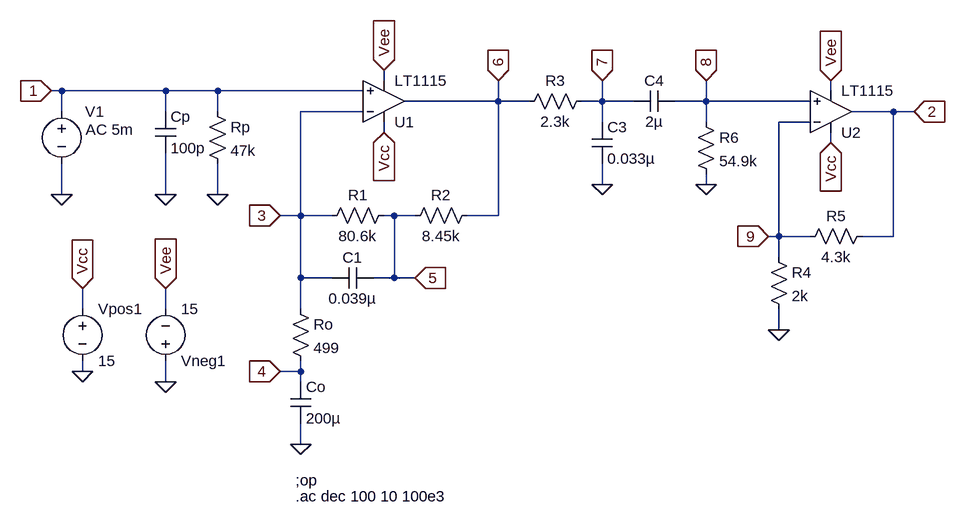
[diagram p0: schematic Two amplifier RIAA Phone Preamp v0b.asc]
Two amplifier RIAA Phone Preamp v0b.asc, the LTspice schematic file:
Version 4
SHEET 1 1876 1124
WIRE 240 160 240 144
WIRE -256 176 -272 176
WIRE -96 176 -256 176
WIRE -16 176 -96 176
WIRE 208 176 -16 176
WIRE 928 176 928 160
WIRE 416 192 416 160
WIRE 416 192 272 192
WIRE 464 192 416 192
WIRE 576 192 576 160
WIRE 576 192 544 192
WIRE 624 192 576 192
WIRE 736 192 736 160
WIRE 736 192 688 192
WIRE 896 192 736 192
WIRE -256 208 -256 176
WIRE -96 208 -96 176
WIRE -16 208 -16 176
WIRE 208 208 112 208
WIRE 1024 208 960 208
WIRE 1056 208 1024 208
WIRE 576 224 576 192
WIRE 736 224 736 192
WIRE 896 224 848 224
WIRE 240 240 240 224
WIRE 928 256 928 240
WIRE 576 320 576 288
WIRE 736 320 736 304
WIRE -256 336 -256 288
WIRE -96 336 -96 272
WIRE -16 336 -16 288
WIRE 112 368 112 208
WIRE 112 368 80 368
WIRE 160 368 112 368
WIRE 256 368 240 368
WIRE 288 368 256 368
WIRE 416 368 416 192
WIRE 416 368 368 368
WIRE 848 400 848 224
WIRE 848 400 832 400
WIRE 896 400 848 400
WIRE 1024 400 1024 208
WIRE 1024 400 976 400
WIRE 848 432 848 400
WIRE 112 464 112 368
WIRE 160 464 112 464
WIRE 256 464 256 368
WIRE 256 464 224 464
WIRE 288 464 256 464
WIRE -224 512 -224 480
WIRE -96 512 -96 480
WIRE 112 512 112 464
WIRE 848 544 848 512
WIRE -224 608 -224 592
WIRE 112 608 112 592
WIRE 112 608 80 608
WIRE -96 624 -96 592
WIRE 112 624 112 608
WIRE 112 720 112 688
FLAG -256 336 0
FLAG 112 720 0
FLAG -96 624 0
FLAG -224 608 0
FLAG -272 176 1
IOPIN -272 176 In
FLAG 80 368 3
IOPIN 80 368 In
FLAG 80 608 4
IOPIN 80 608 In
FLAG 288 464 5
IOPIN 288 464 In
FLAG 416 160 6
IOPIN 416 160 In
FLAG -96 336 0
FLAG -224 480 Vcc
IOPIN -224 480 In
FLAG -96 480 Vee
IOPIN -96 480 In
FLAG 240 240 Vcc
IOPIN 240 240 In
FLAG 240 144 Vee
IOPIN 240 144 In
FLAG 928 256 Vcc
IOPIN 928 256 In
FLAG 928 160 Vee
IOPIN 928 160 In
FLAG -16 336 0
FLAG 576 320 0
FLAG 736 320 0
FLAG 848 544 0
FLAG 576 160 7
IOPIN 576 160 In
FLAG 736 160 8
IOPIN 736 160 In
FLAG 832 400 9
IOPIN 832 400 In
FLAG 1056 208 2
IOPIN 1056 208 In
SYMBOL voltage -256 192 R0
WINDOW 3 24 44 Left 2
WINDOW 123 37 44 Left 2
WINDOW 0 36 16 Left 2
WINDOW 39 0 0 Left 2
SYMATTR Value ""
SYMATTR Value2 AC 5m
SYMATTR InstName V1
SYMBOL cap 160 480 R270
WINDOW 0 32 32 VTop 2
WINDOW 3 0 32 VBottom 2
SYMATTR InstName C1
SYMATTR Value 0.039µ
SYMBOL cap 96 624 R0
SYMATTR InstName Co
SYMATTR Value 200µ
SYMBOL res 96 496 R0
SYMATTR InstName Ro
SYMATTR Value 499
SYMBOL res 448 208 R270
WINDOW 0 32 56 VTop 2
WINDOW 3 0 56 VBottom 2
SYMATTR InstName R3
SYMATTR Value 2.3k
SYMBOL res 144 384 R270
WINDOW 0 32 56 VTop 2
WINDOW 3 0 56 VBottom 2
SYMATTR InstName R1
SYMATTR Value 80.6k
SYMBOL res 272 384 R270
WINDOW 0 32 56 VTop 2
WINDOW 3 0 56 VBottom 2
SYMATTR InstName R2
SYMATTR Value 8.45k
SYMBOL voltage -96 608 M180
WINDOW 123 0 0 Left 2
WINDOW 39 0 0 Left 2
SYMATTR InstName Vneg1
SYMATTR Value 15
SYMBOL voltage -224 496 R0
WINDOW 123 0 0 Left 2
WINDOW 39 0 0 Left 2
SYMATTR InstName Vpos1
SYMATTR Value 15
SYMBOL cap -112 208 R0
SYMATTR InstName Cp
SYMATTR Value 100p
SYMBOL res -32 192 R0
SYMATTR InstName Rp
SYMATTR Value 47k
SYMBOL cap 560 224 R0
SYMATTR InstName C3
SYMATTR Value 0.033µ
SYMBOL cap 688 176 R90
WINDOW 0 0 32 VBottom 2
WINDOW 3 32 32 VTop 2
SYMATTR InstName C4
SYMATTR Value 2µ
SYMBOL res 720 208 R0
SYMATTR InstName R6
SYMATTR Value 54.9k
SYMBOL res 832 416 R0
SYMATTR InstName R4
SYMATTR Value 2k
SYMBOL res 992 384 R90
WINDOW 0 0 56 VBottom 2
WINDOW 3 32 56 VTop 2
SYMATTR InstName R5
SYMATTR Value 4.3k
SYMBOL OpAmps\\LT1115 240 256 M180
SYMATTR InstName U1
SYMBOL OpAmps\\LT1115 928 272 M180
SYMATTR InstName U2
TEXT 104 776 Left 2 !;op
TEXT 104 800 Left 2 !.ac dec 100 10 100e3

The netlist it stands for:
* Two amplifier RIAA Phone Preamp v0b.asc
V1 1 0 AC 5m
C1 3 5 0.039µ
Co 4 0 200µ
Ro 3 4 499
R3 6 7 2.3k
R1 3 5 80.6k
R2 5 6 8.45k
Vneg1 0 Vee 15
Vpos1 Vcc 0 15
Cp 1 0 100p
Rp 1 0 47k
C3 7 0 0.033µ
C4 8 7 2µ
R6 8 0 54.9k
R4 9 0 2k
R5 2 9 4.3k
XU1 1 3 Vcc Vee 6 LT1028  ; LT1115, pins In+ In- V+ V- OUT
XU2 8 9 Vcc Vee 2 LT1028  ; LT1115, pins In+ In- V+ V- OUT
;op
.ac dec 100 10 100e3
.lib LTC.lib
.backanno
.end